# EAGLE design ATtiny prog board (EAGLE 7.3.0)
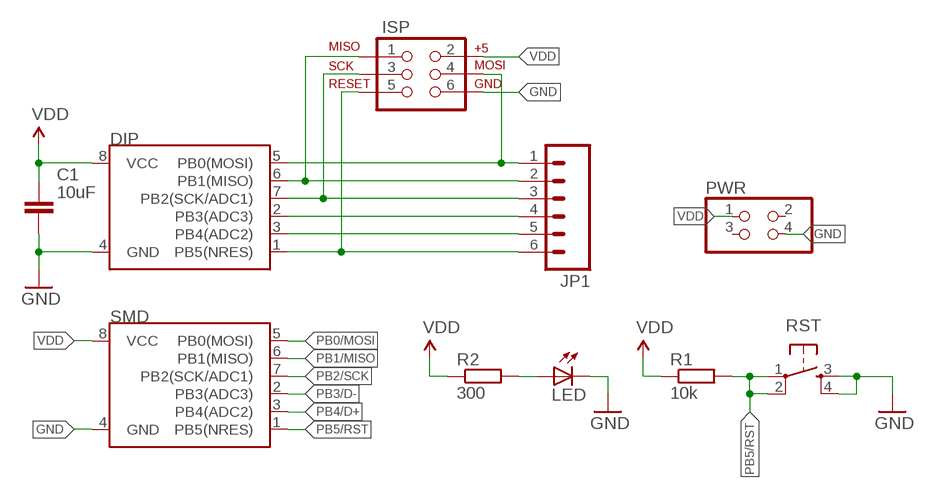
[diagram p0: schematic, sheet 1]

## Parts
C1  10uF  CAPACITOR_NPOL-0805  [C805]
DIP  ATTINY45TINY85-20-DIP  [DIP08]
ISP  AVR_SPI_PRG_6PTH  [2X3]
JP1  M06SILK_FEMALE_PTH  [1X06]
LED  LED-0603  [LED-603]
PWR  PINHD-2X2  [2X02]
R1  10k  RESISTOR-0603  [R603]
R2  300  RESISTOR-0603  [R603]
RST  TAC_SWITCHPTH  [TACTILE-PTH]
SMD  ATTINY45TINY85-20-SMT  [SO08-EIAJ]

## Nets
GND: C1.2 DIP.4(GND) ISP.6 LED.C PWR.4 RST.3 RST.4 SMD.4(GND)
N$1: LED.A R2.2
PB0/MOSI: DIP.5(PB0(MOSI)) ISP.4 JP1.1 SMD.5(PB0(MOSI))
PB1/MISO: DIP.6(PB1(MISO)) ISP.1 JP1.2 SMD.6(PB1(MISO))
PB2/SCK: DIP.7(PB2(SCK/ADC1)) ISP.3 JP1.3 SMD.7(PB2(SCK/ADC1))
PB3/D-: DIP.2(PB3(ADC3)) JP1.4 SMD.2(PB3(ADC3))
PB4/D+: DIP.3(PB4(ADC2)) JP1.5 SMD.3(PB4(ADC2))
PB5/RST: DIP.1(PB5(NRES)) ISP.5 JP1.6 R1.2 RST.1 RST.2 SMD.1(PB5(NRES))
VDD: C1.1 DIP.8(VCC) ISP.2 PWR.1 R1.1 R2.1 SMD.8(VCC)
Unconnected: PWR.2 PWR.3

## Library data of the parts
C1 = dp_devices:CAPACITOR_NPOL: Non-Polarized capacitor in various packages
DIP = SparkFun-DigitalIC:ATTINY45: Atmel 8-pin 2/4/8kB flash uC; PROD_ID: IC-09445; VALUE: TINY85-20-DIP
ISP = SparkFun-Connectors:AVR_SPI_PRG_6: AVR ISP 6 Pin This is the reduced ISP connector for AVR programming. Common on Arduino. This footprint will take up less PCB space and can be used with a 10-pin to 6-pin adapter such as SKU: BOB-08508 **Special note about "TEST_POINT" package. The stop mask is on the top side, so if you want your programming test points to be on the bottom of your board, make sure to place this package on the bottom side of the board. This also ensure that the orientation to program from the bottom side will be correct.
JP1 = SparkFun-Connectors:M06: Header 6 Standard 6-pin 0.1" header. Use with straight break away headers (SKU : PRT-00116), right angle break away headers (PRT-00553), swiss pins (PRT-00743), machine pins (PRT-00117), and female headers (PRT-00115). Molex polarized connector foot print use with SKU : PRT-08094 with associated crimp pins and housings. NOTES ON THE VARIANTS LOCK and LOCK_LONGPADS... This footprint was designed to help hold the alignment of a through-hole component (i.e. 6-pin header) while soldering it into place. You may notice that each hole has been shifted either up or down by 0.005 of an inch from it's more standard position (which is a perfectly straight line). This slight alteration caused the pins (the squares in the middle) to touch the edges of the holes. Because they are alternating, it causes a "brace" to hold the component in place. 0.005 has proven to be the perfect amount of "off-center" position when using our standard breakaway headers. Although looks a little odd when you look at the bare footprint, once you have a header in there, the alteration is very hard to notice. Also,if you push a header all the way into place, it is covered up entirely on the bottom side. This idea of altering the position of holes to aid alignment will be further integrated into the Sparkfun Library for other footprints. It can help hold any component with 3 or more connection pins.; PROD_ID: CONN-08437
LED = dp_devices:LED: Light Emitting Diode
PWR = pinhead:PINHD-2X2: PIN HEADER
R1 R2 = dp_devices:RESISTOR
RST = SparkFun-Retired:TAC_SWITCH: Momentary Switch Button commonly used for reset or general input. Spark Fun Electronics SKU : COM-00097 SMT- SWCH-08247
SMD = SparkFun-DigitalIC:ATTINY45: Atmel 8-pin 2/4/8kB flash uC; PROD_ID: IC-09092; VALUE: Tiny85-20-SMT

## Board
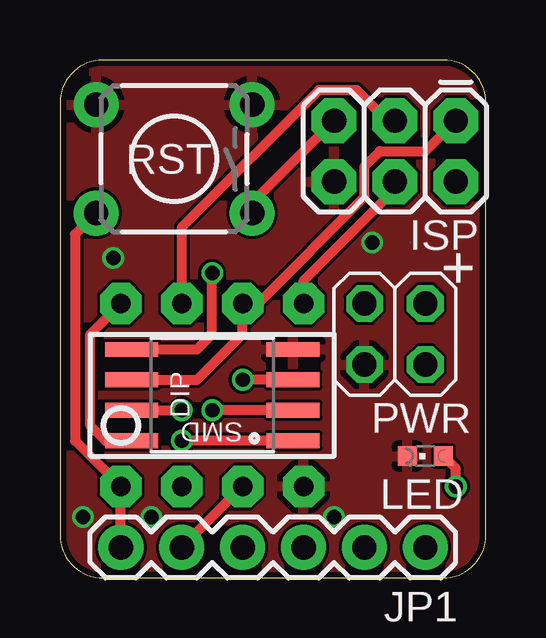
[diagram p1: board, top side]
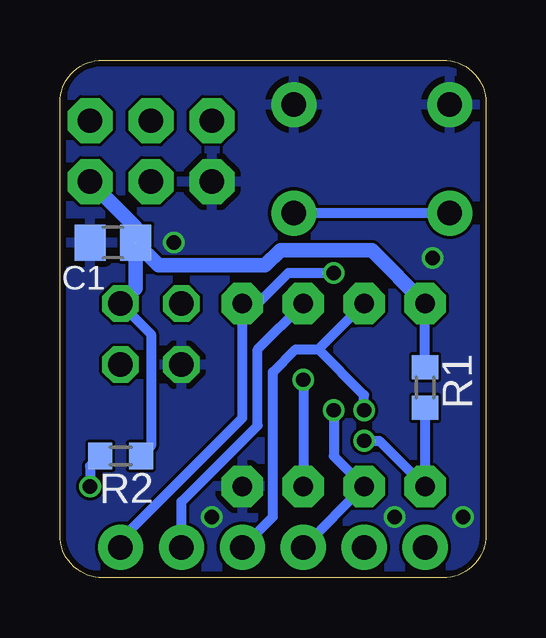
[diagram p2: board, bottom side, seen from below]

Size 17.77 x 21.58 mm. Coordinates in mm from the lower left corner, seen from the top.
Outline: 0,19.79 0,1.8 arc90 1.8,0 15.98,0 arc90 17.77,1.79 17.77,19.8 arc90 15.99,21.58 1.79,21.58 arc90 0,19.79
Copper layers (1*16): Top 0.035mm / dielectric 1.5mm / Bottom 0.035mm
Design rules "dirt_cheap_dirty_boards.v1": minimum track width 5mil, minimum drill 12mil, track to track 5mil, track to pad 5mil, pad to pad 5mil, via to via 5mil, smd to smd 0mil, copper to edge 10mil, drill to drill 10mil, minimum pad ring 10mil, minimum via ring 6mil, stop-mask expansion 2mil, vias tented up to drill 25mil, thermal gap 10mil

### Footprints (pad centres in the part's own frame; a part is rotated, then mirrored left to right if it is on the bottom)
C805 = smd 1.3 x 1.5: 1 -0.95,0; 2 0.95,0
DIP08 = drill 0.813 pad 1.727 octagon: 1 -3.81,-3.81; 2 -1.27,-3.81; 3 1.27,-3.81; 4 3.81,-3.81; 5 3.81,3.81; 6 1.27,3.81; 7 -1.27,3.81; 8 -3.81,3.81
2X3 = drill 1.016 pad 1.88 octagon: 1 0,0; 2 0,2.54; 3 2.54,0; 4 2.54,2.54; 5 5.08,0; 6 5.08,2.54
1X06 = drill 1.016 pad 1.88: 1 0,0; 2 2.54,0; 3 5.08,0; 4 7.62,0; 5 10.16,0; 6 12.7,0
LED-603 = smd 0.8 x 0.8: A 0,-0.75; C 0,0.75
2X02 = drill 1.016 octagon: 1 -1.27,-1.27; 2 -1.27,1.27; 3 1.27,-1.27; 4 1.27,1.27
R603 = smd 1 x 1.1: 1 -0.85,0; 2 0.85,0
TACTILE-PTH = drill 1.016 pad 1.88: 1 -3.251,2.261; 2 3.251,2.261; 3 -3.251,-2.261; 4 3.251,-2.261
SO08-EIAJ = smd 0.61 x 2.21: 1 -1.905,-3.378; 2 -0.635,-3.378; 3 0.635,-3.378; 4 1.905,-3.378; 5 1.905,3.353; 6 0.635,3.353; 7 -0.635,3.353; 8 -1.905,3.353

### Placement (x,y rotation side)
C1  15.56,13.97 180 bottom
DIP  6.35,7.62 0 top
ISP  16.51,19.05 180 top
JP1  15.24,1.27 180 top
LED  15.24,5.08 90 top
PWR  13.97,10.16 180 top
R1  2.54,7.94 270 bottom
R2  15.24,5.08 180 bottom
RST  4.76,17.46 180 top
SMD  6.35,7.62 90 top

### Tracks (layer width: path | path; a pad name or v marks a point on that pad's centre or on a via)
GND  (via drill 0.6)
  other vias: 13.02,13.97 2.22,13.34 0.95,2.54 11.43,2.54 3.81,2.54
  pour Bottom: 0,0 17.78,0 17.78,21.59 0,21.59
  pour Top: 0,0 17.78,0 17.78,21.59 0,21.59
N$1  (via drill 0.6)
  Top 0.406: v16.51,3.81 16.51,4.56 LED.A
  Bottom 0.406: R2.2 16.51,4.66 v16.51,3.81
PB0/MOSI  (via drill 0.6)
  Top 0.406: SMD.5 5.71,9.53 6.35,10.16 v6.35,12.7 | DIP.5 10.16,12.38 13.97,16.19 ISP.4
  Bottom 0.406: JP1.1 15.24,1.59 10.16,6.67 DIP.5 9.53,11.43 8.26,12.7 v6.35,12.7
PB1/MISO
  Top 0.406: SMD.6 5.71,8.26 7.62,10.16 DIP.6 8.26,11.43 12.7,15.88 12.7,17.14 13.34,17.78 15.24,17.78 ISP.1
  Bottom 0.406: JP1.2 12.7,3.17 9.53,6.35 9.53,9.53 DIP.6
PB2/SCK  (via drill 0.6)
  Top 0.406: SMD.7 v5.08,6.99 | ISP.3 13.65,19.05 12.38,20.32 10.79,20.32 5.08,14.61 DIP.7
  Bottom 0.406: JP1.3 8.89,2.54 8.89,8.57 7.94,9.53 6.99,9.53 | 6.99,9.53 DIP.7 | v5.08,6.99 5.08,7.62 6.99,9.53
PB3/D-  (via drill 0.6)
  Top 0.406: SMD.2 v6.35,6.99
  Bottom 0.406: JP1.4 DIP.2 6.35,5.08 v6.35,6.99
PB4/D+  (via drill 0.6)
  Top 0.406: DIP.3 JP1.5 | SMD.3 v7.62,8.26
  Bottom 0.406: v7.62,8.26 DIP.3
PB5/RST  (via drill 0.6)
  Top 0.406: JP1.6 DIP.1 0.64,5.71 0.64,14.33 RST.2 | SMD.1 v5.08,5.71 | RST.1 8.01,15.63 ISP.5
  Bottom 0.406: R1.2 DIP.1 4.45,5.71 v5.08,5.71 | RST.2 RST.1
VDD  (1 unrouted)
  Top 0.406: SMD.8 1.91,5.71 1.27,6.35 1.27,10.16 DIP.8
  Bottom 0.406: R1.1 DIP.8 | PWR.1 13.97,10.16 13.97,5.5 R2.1
  Bottom 0.61: PWR.1 14.61,12.06 C1.1 14.61,14.61 ISP.2 | DIP.8 4.76,13.65 8.57,13.65 9.21,13.02 13.65,13.02 C1.1

### Text on the board
tNames: +